# EAGLE design modEEGamp_v1.1 (EAGLE 7.6.0)
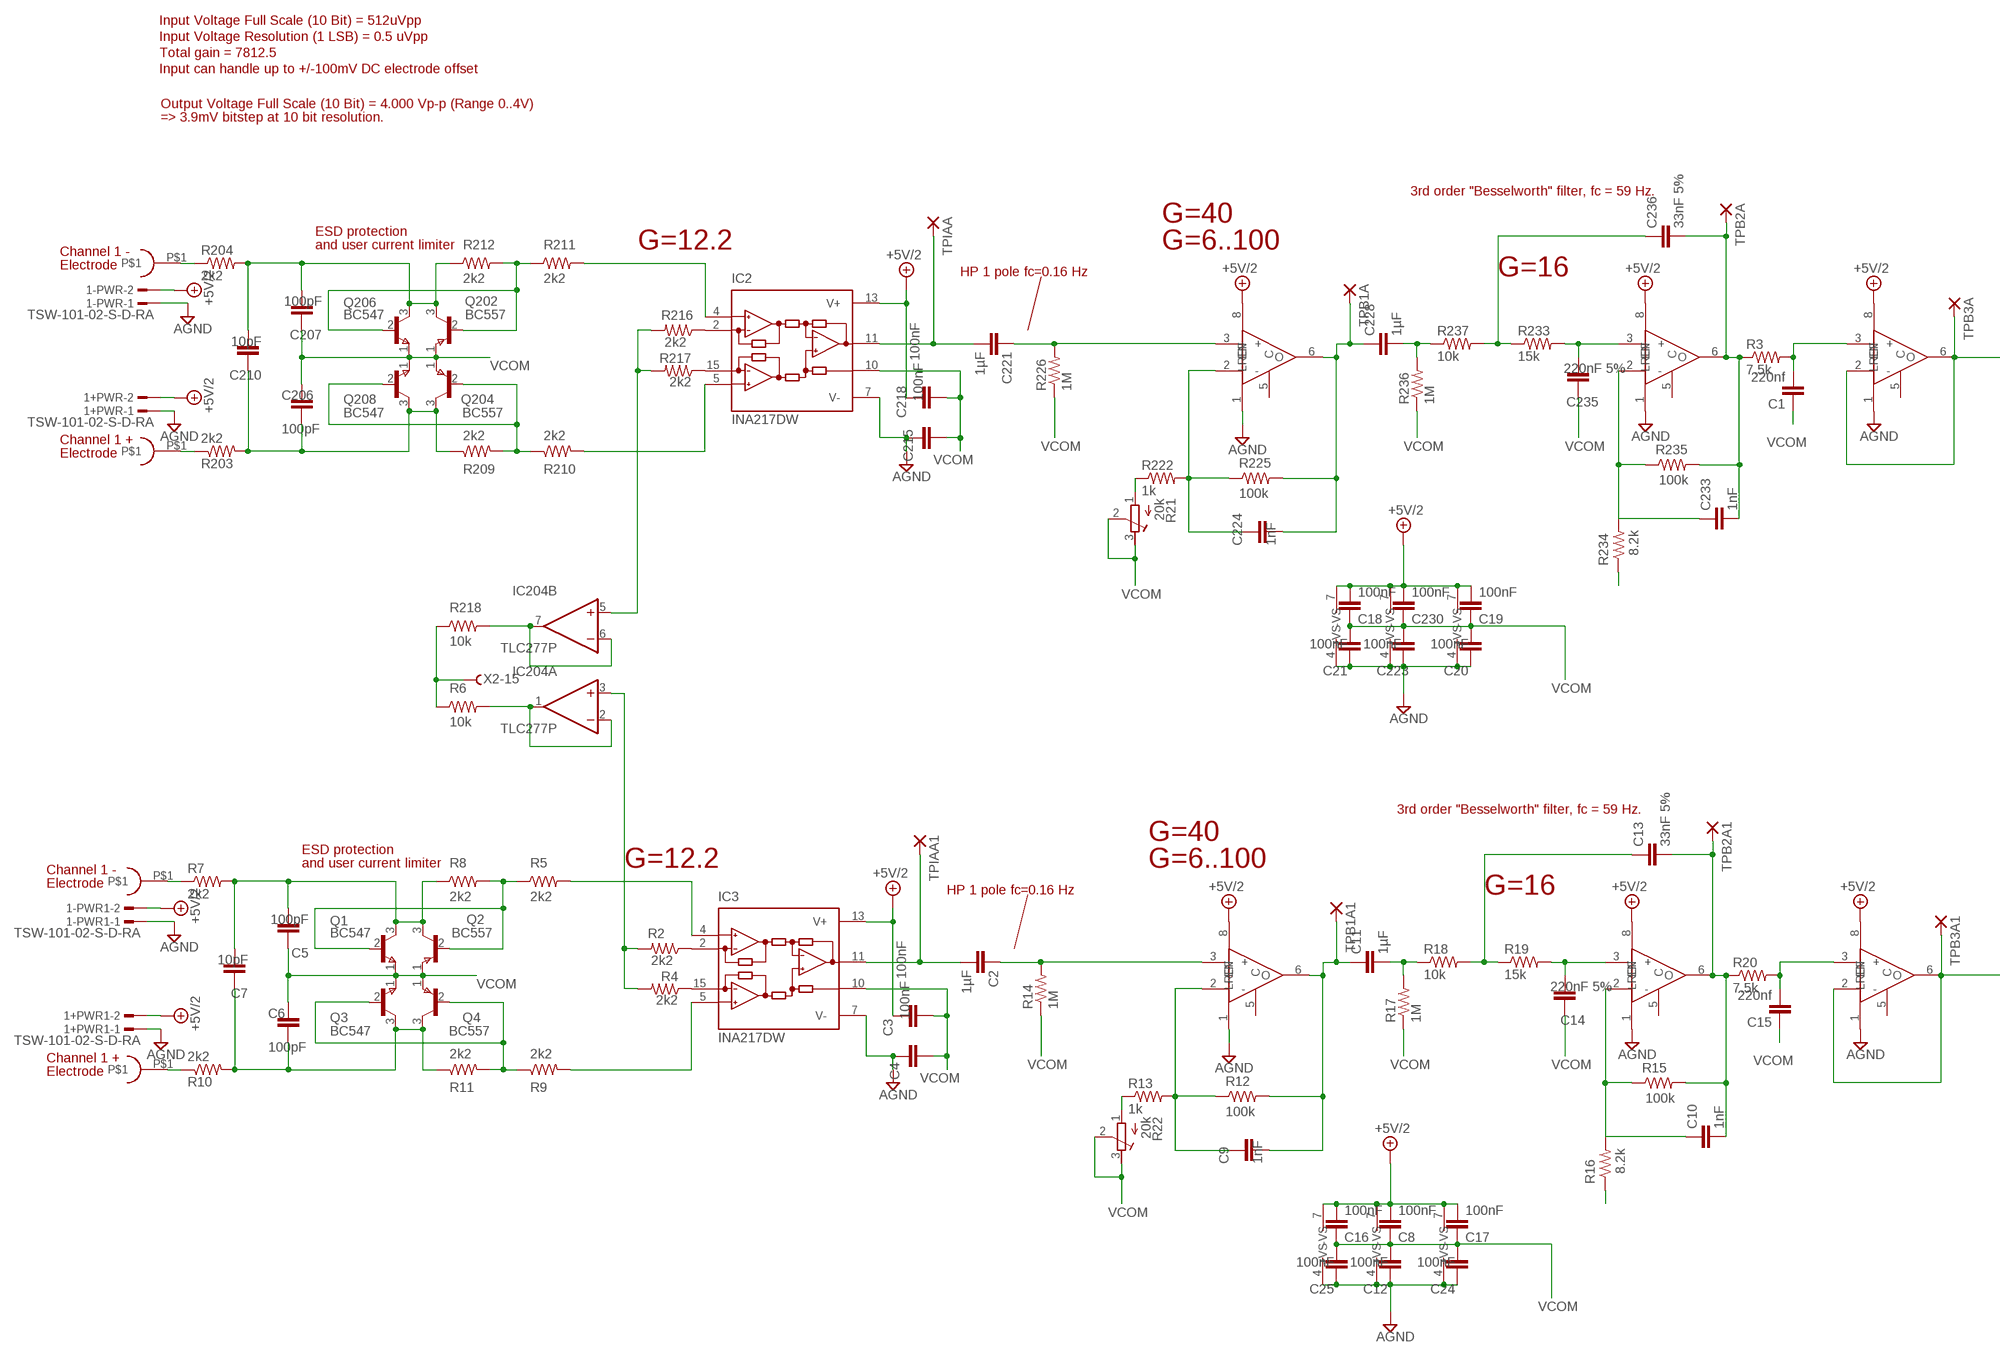
[diagram p0: schematic, sheet 1, part 1 of 2]
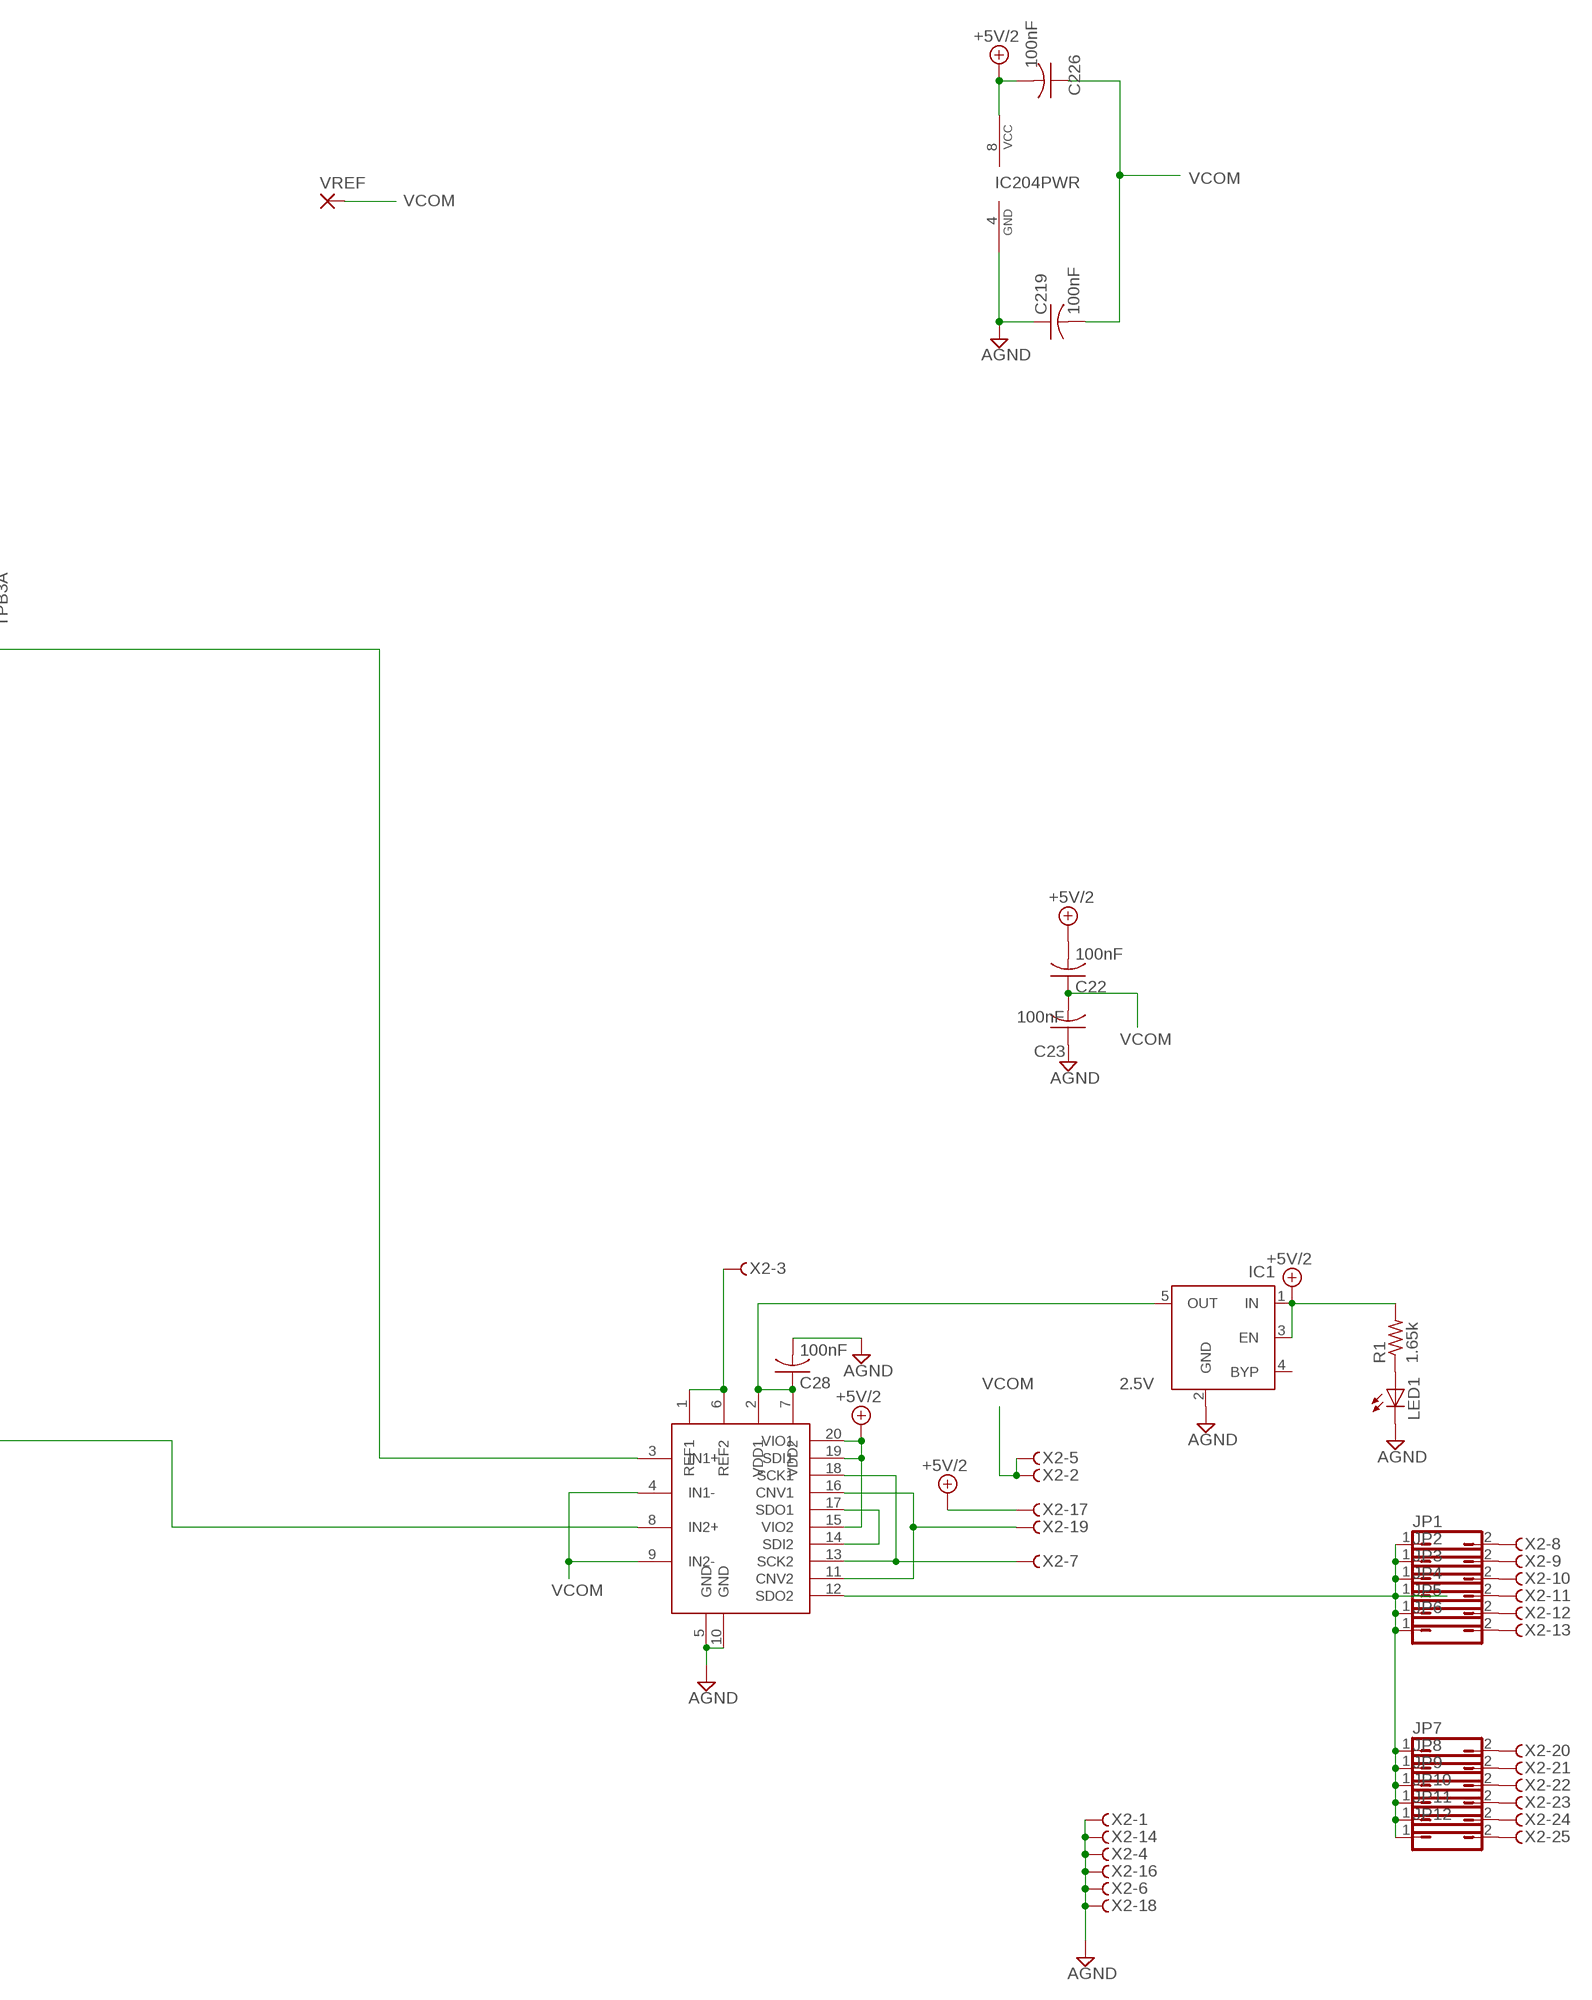
[diagram p1: schematic, sheet 1, part 2 of 2]

## Parts
1+PWR  TSW-101-02-S-D-RA  [TSW-101-02-S-D-RA]
1+PWR1  TSW-101-02-S-D-RA  [TSW-101-02-S-D-RA]
1-PWR  TSW-101-02-S-D-RA  [TSW-101-02-S-D-RA]
1-PWR1  TSW-101-02-S-D-RA  [TSW-101-02-S-D-RA]
C1  220nf  C-EUC1206  [C1206]
C1+  DIN42802  [DIN42802]
C1+1  DIN42802  [DIN42802]
C1-  DIN42802  [DIN42802]
C1-1  DIN42802  [DIN42802]
C2  1µF  C-EU050-024X044  [C050-024X044]
C3  100nF  C-EUC1206  [C1206]
C4  100nF  C-EUC1206  [C1206]
C5  100pF  C-EUC1206  [C1206]
C6  100pF  C-EUC1206  [C1206]
C7  10pF  C-EUC1206  [C1206]
C8  100nF  C-EUC1206  [C1206]
C9  1nF  C-EUC1206  [C1206]
C10  1nF  C-EUC1206  [C1206]
C11  1µF  C-EU050-024X044  [C050-024X044]
C12  100nF  C-EUC1206  [C1206]
C13  33nF 5%  C-EUC1206  [C1206]
C14  220nF 5%  C-EUC1206  [C1206]
C15  220nf  C-EUC1206  [C1206]
C16  100nF  C-EUC1206  [C1206]
C17  100nF  C-EUC1206  [C1206]
C18  100nF  C-EUC1206  [C1206]
C19  100nF  C-EUC1206  [C1206]
C20  100nF  C-EUC1206  [C1206]
C21  100nF  C-EUC1206  [C1206]
C22  100nF  C-USC1206  [C1206]
C23  100nF  C-USC1206  [C1206]
C24  100nF  C-EUC1206  [C1206]
C25  100nF  C-EUC1206  [C1206]
C28  100nF  C-USC1206  [C1206]
C206  100pF  C-EUC1206  [C1206]
C207  100pF  C-EUC1206  [C1206]
C210  10pF  C-EUC1206  [C1206]
C215  100nF  C-EUC1206  [C1206]
C218  100nF  C-EUC1206  [C1206]
C219  100nF  C-USC1206  [C1206]
C221  1µF  C-EU050-024X044  [C050-024X044]
C223  100nF  C-EUC1206  [C1206]
C224  1nF  C-EUC1206  [C1206]
C226  100nF  C-USC1206  [C1206]
C228  1µF  C-EU050-024X044  [C050-024X044]
C230  100nF  C-EUC1206  [C1206]
C233  1nF  C-EUC1206  [C1206]
C235  220nF 5%  C-EUC1206  [C1206]
C236  33nF 5%  C-EUC1206  [C1206]
IC1  2.5V  MIC5219XX  [SOT23-5]
IC2  INA217DW  [DW_RPDSO-G16]
IC3  INA217DW  [DW_RPDSO-G16]
IC204  TLC277P  [DIL-08]
JP1  JP1Q  [JP1]
JP2  JP1Q  [JP1]
JP3  JP1Q  [JP1]
JP4  JP1Q  [JP1]
JP5  JP1Q  [JP1]
JP6  JP1Q  [JP1]
JP7  JP1Q  [JP1]
JP8  JP1Q  [JP1]
JP9  JP1Q  [JP1]
JP10  JP1Q  [JP1]
JP11  JP1Q  [JP1]
JP12  JP1Q  [JP1]
LED1  LED3MM  [LED3MM]
Q1  BC547  [TO92]
Q2  BC557  [TO92]
Q3  BC547  [TO92]
Q4  BC557  [TO92]
Q202  BC557  [TO92]
Q204  BC557  [TO92]
Q206  BC547  [TO92]
Q208  BC547  [TO92]
R1  1.65k  R-US_R1206  [R1206]
R2  2k2  R-US_R1206  [R1206]
R3  7.5k  R-US_R1206  [R1206]
R4  2k2  R-US_R1206  [R1206]
R5  2k2  R-US_R1206  [R1206]
R6  10k  R-US_R1206  [R1206]
R7  2k2  R-US_R1206  [R1206]
R8  2k2  R-US_R1206  [R1206]
R9  2k2  R-US_R1206  [R1206]
R10  2k2  R-US_R1206  [R1206]
R11  2k2  R-US_R1206  [R1206]
R12  100k  R-US_R1206  [R1206]
R13  1k  R-US_R1206  [R1206]
R14  1M  R-US_R1206  [R1206]
R15  100k  R-US_R1206  [R1206]
R16  8.2k  R-US_R1206  [R1206]
R17  1M  R-US_R1206  [R1206]
R18  10k  R-US_R1206  [R1206]
R19  15k  R-US_R1206  [R1206]
R20  7.5k  R-US_R1206  [R1206]
R21  20k  R-TRIMM3296W  [RTRIM3296W]
R22  20k  R-TRIMM3296W  [RTRIM3296W]
R203  2k2  R-US_R1206  [R1206]
R204  2k2  R-US_R1206  [R1206]
R209  2k2  R-US_R1206  [R1206]
R210  2k2  R-US_R1206  [R1206]
R211  2k2  R-US_R1206  [R1206]
R212  2k2  R-US_R1206  [R1206]
R216  2k2  R-US_R1206  [R1206]
R217  2k2  R-US_R1206  [R1206]
R218  10k  R-US_R1206  [R1206]
R222  1k  R-US_R1206  [R1206]
R225  100k  R-US_R1206  [R1206]
R226  1M  R-US_R1206  [R1206]
R233  15k  R-US_R1206  [R1206]
R234  8.2k  R-US_R1206  [R1206]
R235  100k  R-US_R1206  [R1206]
R236  1M  R-US_R1206  [R1206]
R237  10k  R-US_R1206  [R1206]
TPB1A  1,6/0,8  [1,6/0,8]
TPB1A1  1,6/0,8  [1,6/0,8]
TPB2A  1,6/0,8  [1,6/0,8]
TPB2A1  1,6/0,8  [1,6/0,8]
TPB3A  1,6/0,8  [1,6/0,8]
TPB3A1  1,6/0,8  [1,6/0,8]
TPIAA  1,6/0,8  [1,6/0,8]
TPIAA1  1,6/0,8  [1,6/0,8]
U$1  AD7902  [QSOP20]
U$10  AD8021  [SOIC8]
U$12  AD8021  [SOIC8]
U$20  AD8021  [SOIC8]
U$30  AD8021  [SOIC8]
U$31  AD8021  [SOIC8]
U$36  AD8021  [SOIC8]
VREF  1,6/0,8  [1,6/0,8]
X2  F25HPS  [F25HP]

## Nets
+5V/2: 1+PWR1.2 1+PWR.2 1-PWR1.2 1-PWR.2 C3.1 C8.2 C16.2 C17.2 C18.2 C19.2 C22.2 C218.1 C226.2 C230.2 IC1.1(IN) IC1.3(EN) IC2.13(V+) IC3.13(V+) IC204.8(PWR:VCC) R1.2 U$1.15(VIO2) U$1.19(SDI1) U$1.20(VIO1) U$10.7(SUPPLY:+VS) U$10.8(IC:EN) U$12.7(SUPPLY:+VS) U$12.8(IC:EN) U$20.7(SUPPLY:+VS) U$20.8(IC:EN) U$30.7(SUPPLY:+VS) U$30.8(IC:EN) U$31.7(SUPPLY:+VS) U$31.8(IC:EN) U$36.7(SUPPLY:+VS) U$36.8(IC:EN) X2.17
ADIN0: TPB3A.1(P) U$1.3(IN1+) U$20.2(IC:-) U$20.6(IC:O)
ADIN1: TPB3A1.1(P) U$1.8(IN2+) U$36.2(IC:-) U$36.6(IC:O)
AGND: 1+PWR1.1 1+PWR.1 1-PWR1.1 1-PWR.1 C4.1 C12.1 C20.1 C21.1 C23.1 C24.1 C25.1 C28.2 C215.1 C219.1 C223.1 IC1.2(GND) IC2.7(V-) IC3.7(V-) IC204.4(PWR:GND) LED1.K(C) U$1.5(GND) U$1.10(GND) U$10.1(IC:LREF) U$10.4(SUPPLY:-VS) U$12.1(IC:LREF) U$12.4(SUPPLY:-VS) U$20.1(IC:LREF) U$20.4(SUPPLY:-VS) U$30.1(IC:LREF) U$30.4(SUPPLY:-VS) U$31.1(IC:LREF) U$31.4(SUPPLY:-VS) U$36.1(IC:LREF) U$36.4(SUPPLY:-VS) X2.1 X2.4 X2.6 X2.14 X2.16 X2.18
CNV: U$1.11(CNV2) U$1.16(CNV1) X2.19
N$1: U$1.1(REF1) U$1.6(REF2) X2.3
N$2: C28.1 IC1.5(OUT) U$1.2(VDD1) U$1.7(VDD2)
N$3: JP1.1 JP2.1 JP3.1 JP4.1 JP5.1 JP6.1 JP7.1 JP8.1 JP9.1 JP10.1 JP11.1 JP12.1 U$1.12(SDO2)
N$4: U$1.14(SDI2) U$1.17(SDO1)
N$5: C1-.P$1 R204.1
N$6: R13.1 R22.1(A)
N$7: C1+.P$1 R203.1
N$8: R21.1(A) R222.1
N$9: LED1.A R1.1
N$10: JP1.2 X2.8
N$11: JP2.2 X2.9
N$12: IC204.5(B:+IN) R216.2 R217.2
N$13: C233.2 C236.2 R3.1 R235.2 TPB2A.1(P) U$12.6(IC:O)
N$14: IC2.2(RG1) R216.1
N$15: C1.2 R3.2 U$20.3(IC:+)
N$16: IC204.3(A:+IN) R2.2 R4.2
N$17: C2.2 IC3.11(OUT) TPIAA1.1(P)
N$18: IC3.4(-IN) R5.2
N$19: IC3.5(+IN) R9.2
N$20: IC2.15(RG2) R217.1
N$21: IC2.4(-IN) R211.2
N$22: Q1.2(B) Q2.2(B) R5.1 R8.2
N$23: C5.2 C7.2 Q1.3(C) Q2.3(C) R7.2 R8.1
N$24: Q3.2(B) Q4.2(B) R9.1 R11.2
N$25: C221.2 IC2.11(OUT) TPIAA.1(P)
N$26: C6.1 C7.1 Q3.3(C) Q4.3(C) R10.2 R11.1
N$27: IC2.5(+IN) R210.2
N$28: C221.1 R226.2 U$10.3(IC:+)
N$29: Q202.2(B) Q206.2(B) R211.1 R212.2
N$30: C1-1.P$1 R7.1
N$31: C1+1.P$1 R10.1
N$32: C207.2 C210.2 Q202.3(C) Q206.3(C) R204.2 R212.1
N$33: C2.1 R14.2 U$30.3(IC:+)
N$34: C9.1 R12.1 R13.2 U$30.2(IC:-)
N$35: IC204.1(A:OUT) IC204.2(A:-IN) R6.2
N$36: JP3.2 X2.10
N$37: C9.2 C11.1 R12.2 TPB1A1.1(P) U$30.6(IC:O)
N$38: C224.1 R222.2 R225.1 U$10.2(IC:-)
N$39: Q204.2(B) Q208.2(B) R209.2 R210.1
N$40: JP4.2 X2.11
N$41: C13.1 R18.2 R19.1
N$42: C224.2 C228.1 R225.2 TPB1A.1(P) U$10.6(IC:O)
N$43: C206.1 C210.1 Q204.3(C) Q208.3(C) R203.2 R209.1
N$44: C14.2 R19.2 U$31.3(IC:+)
N$45: C11.2 R17.2 R18.1
N$46: C10.1 R15.1 R16.2 U$31.2(IC:-)
N$47: IC3.2(RG1) R2.1
N$48: IC3.15(RG2) R4.1
N$49: C233.1 R234.2 R235.1 U$12.2(IC:-)
N$50: C228.2 R236.2 R237.1
N$51: C236.1 R233.1 R237.2
N$52: IC204.6(B:-IN) IC204.7(B:OUT) R218.2
N$53: C10.2 C13.2 R15.2 R20.1 TPB2A1.1(P) U$31.6(IC:O)
N$54: C15.2 R20.2 U$36.3(IC:+)
N$55: JP5.2 X2.12
N$56: JP6.2 X2.13
N$57: C235.2 R233.2 U$12.3(IC:+)
N$58: JP7.2 X2.20
N$59: JP8.2 X2.21
N$60: JP9.2 X2.22
N$61: JP10.2 X2.23
N$62: JP11.2 X2.24
N$63: JP12.2 X2.25
N$66: R6.1 R218.1 X2.15
SCK: U$1.13(SCK2) U$1.18(SCK1) X2.7
VCOM: C1.1 C3.2 C4.2 C5.1 C6.2 C8.1 C12.2 C14.1 C15.1 C16.1 C17.1 C18.1 C19.1 C20.2 C21.2 C22.1 C23.2 C24.2 C25.2 C206.2 C207.1 C215.2 C218.2 C219.2 C223.2 C226.1 C230.1 C235.1 IC2.10(REF) IC3.10(REF) Q1.1(E) Q2.1(E) Q3.1(E) Q4.1(E) Q202.1(E) Q204.1(E) Q206.1(E) Q208.1(E) R14.1 R16.1 R17.1 R21.2(S) R21.3(E) R22.2(S) R22.3(E) R226.1 R234.1 R236.1 U$1.4(IN1-) U$1.9(IN2-) VREF.1(P) X2.2 X2.5
Unconnected: IC1.4(BYP) U$10.5(IC:C) U$12.5(IC:C) U$20.5(IC:C) U$30.5(IC:C) U$31.5(IC:C) U$36.5(IC:C)

## Notes on the sheet
- Input Voltage Full Scale (10 Bit) = 512uVpp
- Input Voltage Resolution (1 LSB) = 0.5 uVpp
- Total gain = 7812.5
- Input can handle up to +/-100mV DC electrode offset
- Output Voltage Full Scale (10 Bit) = 4.000 Vp-p (Range 0..4V)
- => 3.9mV bitstep at 10 bit resolution.
- 3rd order "Besselworth" filter, fc = 59 Hz.
- G=40
- ESD protection
- and user current limiter | G=12.2 | G=6..100
- Channel 1 -
- Electrode
- HP 1 pole fc=0.16 Hz | G=16
- Channel 1 +
- Electrode
- 3rd order "Besselworth" filter, fc = 59 Hz.
- G=40
- ESD protection
- and user current limiter | G=12.2 | G=6..100
- Channel 1 -
- Electrode
- HP 1 pole fc=0.16 Hz | G=16
- Channel 1 +
- Electrode

## Library data of the parts
1+PWR 1+PWR1 1-PWR 1-PWR1 = con-samtec:TSW-101-02-S-D: THROUGH-HOLE .025" SQ POST HEADER Source: Samtec TSW.pdf; OC_FARNELL: unknown; OC_NEWARK: unknown
C1-C21 C24 C25 C206 C207 C210 C215 C218 C221 C223 C224 C228 C230 C233 C235 C236 = resistor:C-EU: CAPACITOR, European symbol
C1+ C1+1 C1- C1-1 = modEEG:DIN42802; PN: Plastics1 41828
C22 C23 C28 C219 C226 = resistor:C-US: CAPACITOR, American symbol
IC1 = v-reg-micrel:MIC5219XX: VOLTAGE REGULATOR; OC_FARNELL: unknown; OC_NEWARK: unknown
IC2 IC3 = burr-brown:INA217: Low-Noise, Low-Distortion INSTRUMENTATION AMPLIFIER Replacement for SSM2017 Source: http://focus.ti.com/lit/ds/symlink/ina217.pdf; MF: TEXAS INSTRUMENTS; MPN: INA217AIDWT; OC_FARNELL: 1459470; OC_NEWARK: 02E2758
IC204 = BURR:TLC277P
JP1-JP12 = jumper:JP1Q: JUMPER
LED1 = led:LED: LED OSRAM: - CHIPLED LG R971, LG N971, LY N971, LG Q971, LY Q971, LO R971, LY R971 LH N974, LH R974 LS Q976, LO Q976, LY Q976 LO Q996 - Hyper CHIPLED LW Q18S LB Q993, LB Q99A, LB R99A - SideLED LS A670, LO A670, LY A670, LG A670, LP A670 LB A673, LV A673, LT A673, LW A673 LH A674 LY A675 LS A676, LA A676, LO A676, LY A676, LW A676 LS A679, LY A679, LG A679 - Hyper Micro SIDELED® LS Y876, LA Y876, LO Y876, LY Y876 LT Y87S - SmartLED LW L88C, LW L88S LB L89C, LB L89S, LG L890 LS L89K, LO L89K, LY L89K LS L896, LA L896, LO L896, LY L896 - TOPLED LS T670, LO T670, LY T670, LG T670, LP T670 LSG T670, LSP T670, LSY T670, LOP T670, LYG T670 LG T671, LOG T671, LSG T671 LB T673, LV T673, LT T673, LW T673 LH T674 LS T676, LA T676, LO T676, LY T676, LB T676, LH T676, LSB T676, LW T676 LB T67C, LV T67C, LT T67C, LS T67K, LO T67K, LY T67K, LW E67C LS E67B, LA E67B, LO E67B, LY E67B, LB E67C, LV E67C, LT E67C LW T67C LS T679, LY T679, LG T679 LS T770, LO T770, LY T770, LG T770, LP T770 LB T773, LV T773, LT T773, LW T773 LH T774 LS E675, LA E675, LY E675, LS T675 LS T776, LA T776, LO T776, LY T776, LB T776 LHGB T686 LT T68C, LB T68C - Hyper Mini TOPLED® LB M676 - Mini TOPLED Santana® LG M470 LS M47K, LO M47K, LY M47K Source: http://www.osram.convergy.de LUXEON: - LUMILED® LXK2-PW12-R00, LXK2-PW12-S00, LXK2-PW14-U00, LXK2-PW14-V00 LXK2-PM12-R00, LXK2-PM12-S00, LXK2-PM14-U00 LXK2-PE12-Q00, LXK2-PE12-R00, LXK2-PE12-S00, LXK2-PE14-T00, LXK2-PE14-U00 LXK2-PB12-K00, LXK2-PB12-L00, LXK2-PB12-M00, LXK2-PB14-N00, LXK2-PB14-P00, LXK2-PB14-Q00 LXK2-PR12-L00, LXK2-PR12-M00, LXK2-PR14-Q00, LXK2-PR14-R00 LXK2-PD12-Q00, LXK2-PD12-R00, LXK2-PD12-S00 LXK2-PH12-R00, LXK2-PH12-S00 LXK2-PL12-P00, LXK2-PL12-Q00, LXK2-PL12-R00 Source: www.luxeon.com KINGBRIGHT: KA-3528ASYC Source: www.kingbright.com
Q1 Q3 Q206 Q208 = NPN:BC547
Q2 Q4 Q202 Q204 = pnp:BC557
R1-R20 R203 R204 R209-R212 R216-R218 R222 R225 R226 R233-R237 = resistor:R-US_: RESISTOR, American symbol
R21 R22 = resistor:R-TRIMM: Trimm resistor
TPB1A TPB1A1 TPB2A TPB2A1 TPB3A TPB3A1 TPIAA TPIAA1 VREF = WIREPAD:1,6/0,8: THROUGH-HOLE PAD
U$1 = EEG:AD7902
U$10 U$12 U$20 U$30 U$31 U$36 = EEG:AD8021
X2 = con-subd:F25?S: SUB-D; OC_FARNELL: unknown; OC_NEWARK: unknown

## Board
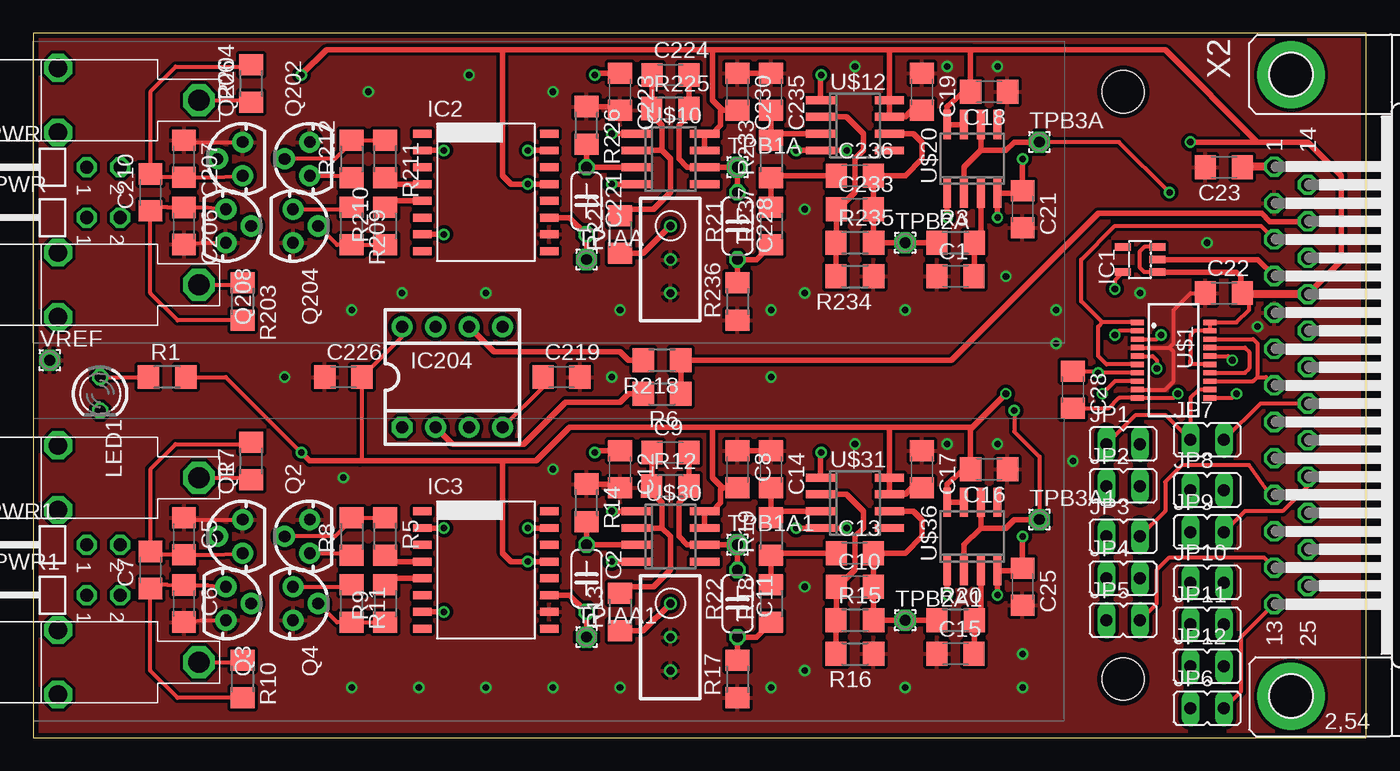
[diagram p2: board, top side]
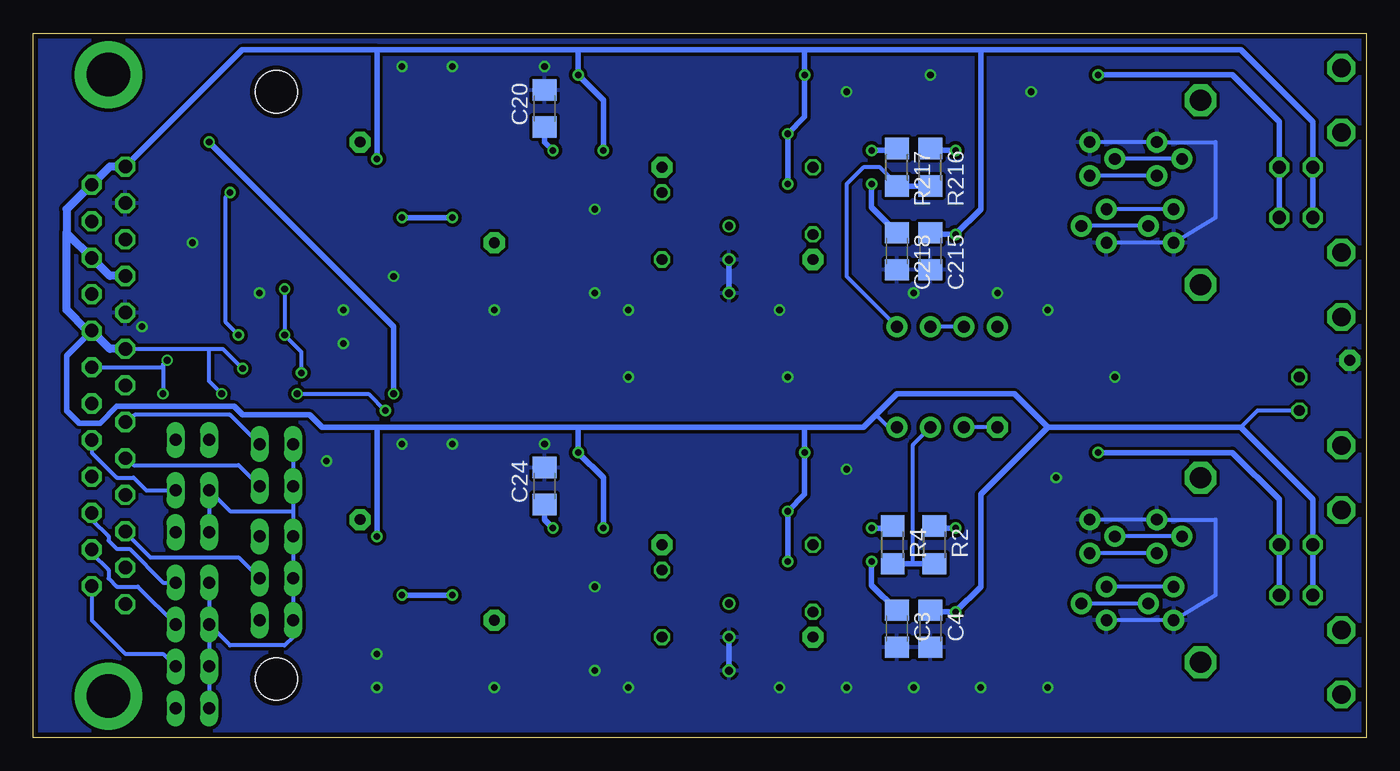
[diagram p3: board, bottom side, seen from below]

Size 100.97 x 53.34 mm. Coordinates in mm from the lower left corner, seen from the top.
Outline: 0,0 100.97,0 100.97,53.34 0,53.34 0,0
Copper layers (1*16): Top 0.0356mm / dielectric 1.5011mm / Bottom 0.0356mm
Design rules "Oshpark": minimum track width 6mil, minimum drill 13mil, track to track 6mil, track to pad 6mil, pad to pad 6mil, via to via 6mil, smd to smd 6mil, copper to edge 15mil, drill to drill 6mil, minimum pad ring 7mil, minimum via ring 7mil, stop-mask expansion 3mil, vias tented up to drill 0mil, thermal gap 10mil
Holes 3.2 mm at 82.55,4.45 82.55,48.9

### Footprints (pad centres in the part's own frame; a part is rotated, then mirrored left to right if it is on the bottom)
TSW-101-02-S-D-RA = drill 1 pad 1.5 octagon: 1 0,1.524; 2 0,4.064
C1206 = smd 1.6 x 1.8: 1 -1.4,0; 2 1.4,0
DIN42802 = drill 1.4 octagon: MNT -2.446,0; MNT@1 2.446,0 | drill 1.6 octagon: P$1 0,-10.655
C050-024X044 = drill 0.813 octagon: 1 -2.54,0; 2 2.54,0
SOT23-5 = smd 0.55 x 1.2: 1 -0.95,-1.3; 2 0,-1.3; 3 0.95,-1.3; 4 0.95,1.3; 5 -0.95,1.3
DW_RPDSO-G16 = smd 0.6 x 1.4: 1 -4.445,-4.8; 2 -3.175,-4.8; 3 -1.905,-4.8; 4 -0.635,-4.8; 5 0.635,-4.8; 6 1.905,-4.8; 7 3.175,-4.8; 8 4.445,-4.8; 9 4.445,4.8; 10 3.175,4.8; 11 1.905,4.8; 12 0.635,4.8; 13 -0.635,4.8; 14 -1.905,4.8; 15 -3.175,4.8; 16 -4.445,4.8
DIL-08 = drill 0.889 pad 1.6 octagon: 1 -3.81,-3.81 | drill 0.889 pad 1.6: 2 -1.27,-3.81; 3 1.27,-3.81; 4 3.81,-3.81; 5 3.81,3.81; 6 1.27,3.81; 7 -1.27,3.81; 8 -3.81,3.81
JP1 = drill 0.914 long: 1 0,-1.27; 2 0,1.27
LED3MM = drill 0.813 octagon: A -1.27,0; K 1.27,0
TO92 = drill 0.889 pad 1.6: 1 1.27,0; 2 0,1.905; 3 -1.27,0
R1206 = smd 1.6 x 1.803: 1 -1.422,0; 2 1.422,0
RTRIM3296W = drill 0.61: 1 0,-2.54; 2 0,0; 3 0,2.54
1,6/0,8 = drill 0.813 pad 1.6 octagon: 1 0,0
QSOP20 = smd 0.4 x 1: 1 -2.858,-2.75; 2 -2.223,-2.75; 3 -1.588,-2.75; 4 -0.953,-2.75; 5 -0.318,-2.75; 6 0.318,-2.75; 7 0.953,-2.75; 8 1.588,-2.75; 9 2.223,-2.75; 10 2.858,-2.75; 11 2.858,2.75; 12 2.223,2.75; 13 1.588,2.75; 14 0.953,2.75; 15 0.318,2.75; 16 -0.318,2.75; 17 -0.953,2.75; 18 -1.588,2.75; 19 -2.223,2.75; 20 -2.858,2.75
SOIC8 = smd 2.2 x 0.6: 1 -2.6,1.905; 2 -2.6,0.635; 3 -2.6,-0.635; 4 -2.6,-1.905; 5 2.6,-1.905; 6 2.6,-0.635; 7 2.6,0.635; 8 2.6,1.905
F25HP = drill 1.016 octagon: 1 -16.561,-1.27; 2 -13.792,-1.27; 3 -11.049,-1.27; 4 -8.28,-1.27; 5 -5.512,-1.27; 6 -2.769,-1.27; 7 0,-1.27; 8 2.769,-1.27; 9 5.512,-1.27; 10 8.28,-1.27; 11 11.049,-1.27; 12 13.792,-1.27; 13 16.561,-1.27; 14 -15.189,1.27; 15 -12.421,1.27; 16 -9.652,1.27; 17 -6.909,1.27; 18 -4.14,1.27; 19 -1.372,1.27; 20 1.372,1.27; 21 4.14,1.27; 22 6.909,1.27; 23 9.652,1.27; 24 12.421,1.27; 25 15.189,1.27 | drill 3.302 pad 5.08: G1 -23.52,0; G2 23.52,0

### Placement (x,y rotation side)
1+PWR  2.54,39.37 270 top
1+PWR1  2.54,10.79 270 top
1-PWR  2.54,43.18 270 top
1-PWR1  2.54,14.61 270 top
C1  69.85,34.92 0 top
C1+  1.91,34.29 90 top
C1+1  1.91,5.71 90 top
C1-  1.91,48.26 90 top
C1-1  1.91,19.68 90 top
C2  41.91,12.06 270 top
C3  35.56,8.26 270 bottom
C4  33.02,8.26 270 bottom
C5  11.43,15.24 270 top
C6  11.43,10.16 270 top
C7  8.89,12.7 90 top
C8  53.34,20.32 270 top
C9  48.26,21.59 0 top
C10  62.23,11.43 0 top
C11  53.34,10.16 270 top
C12  44.45,20.32 270 top
C13  62.23,13.97 0 top
C14  55.88,20.32 270 top
C15  69.85,6.35 0 top
C16  72.39,20.32 180 top
C17  67.31,20.32 270 top
C18  72.39,48.9 180 top
C19  67.31,48.9 270 top
C20  62.23,47.62 90 bottom
C21  74.93,40.01 270 top
C22  90.17,33.66 0 top
C23  90.17,43.18 180 top
C24  62.23,19.05 90 bottom
C25  74.93,11.43 270 top
C28  78.74,26.35 270 top
C206  11.43,38.73 270 top
C207  11.43,43.81 270 top
C210  8.89,41.27 90 top
C215  33.02,36.83 270 bottom
C218  35.56,36.83 270 bottom
C219  40.01,27.3 0 top
C221  41.91,40.64 270 top
C223  44.45,48.9 270 top
C224  48.26,50.16 0 top
C226  23.5,27.3 0 top
C228  53.34,38.73 270 top
C230  53.34,48.9 270 top
C233  62.23,40.01 0 top
C235  55.88,48.9 270 top
C236  62.23,42.55 0 top
IC1  83.82,36.2 90 top
IC2  34.29,41.27 270 top
IC3  34.29,12.7 270 top
IC204  31.75,27.3 0 top
JP1  82.55,22.23 270 top
JP2  82.55,19.05 270 top
JP3  82.55,15.24 270 top
JP4  82.55,12.06 270 top
JP5  82.55,8.89 270 top
JP6  88.9,2.22 270 top
JP7  88.9,22.54 270 top
JP8  88.9,18.73 270 top
JP9  88.9,15.56 270 top
JP10  88.9,11.75 270 top
JP11  88.9,8.57 270 top
JP12  88.9,5.4 270 top
LED1  5.08,26.04 270 top
Q1  15.88,15.24 90 top
Q2  20.95,15.24 90 top
Q3  14.61,10.16 270 top
Q4  19.68,10.16 270 top
Q202  20.95,43.81 90 top
Q204  19.68,38.73 270 top
Q206  15.88,43.81 90 top
Q208  14.61,38.73 270 top
R1  10.16,27.3 0 top
R2  32.7,14.61 270 bottom
R3  69.85,37.47 0 top
R4  35.88,14.61 270 bottom
R5  26.67,15.24 270 top
R6  47.62,26.04 180 top
R7  16.51,20.95 90 top
R8  24.13,15.24 90 top
R9  26.67,10.16 90 top
R10  15.88,4.45 270 top
R11  24.13,10.16 270 top
R12  48.26,19.05 0 top
R13  44.45,9.53 90 top
R14  41.91,17.78 270 top
R15  62.23,8.89 0 top
R16  62.23,6.35 180 top
R17  53.34,4.45 90 top
R18  55.88,10.16 90 top
R19  55.88,15.24 90 top
R20  69.85,8.89 0 top
R21  48.26,36.2 180 top
R22  48.26,7.62 180 top
R203  15.88,33.02 270 top
R204  16.51,49.53 90 top
R209  24.13,38.73 270 top
R210  26.67,38.73 90 top
R211  26.67,43.81 270 top
R212  24.13,43.81 90 top
R216  33.02,43.18 270 bottom
R217  35.56,43.18 270 bottom
R218  47.62,28.57 180 top
R222  44.45,38.1 90 top
R225  48.26,47.62 0 top
R226  41.91,46.35 270 top
R233  55.88,43.81 90 top
R234  62.23,34.92 180 top
R235  62.23,37.47 0 top
R236  53.34,33.02 90 top
R237  55.88,38.73 90 top
TPB1A  53.34,43.18 0 top
TPB1A1  53.34,14.61 0 top
TPB2A  66.04,37.47 0 top
TPB2A1  66.04,8.89 0 top
TPB3A  76.2,45.09 0 top
TPB3A1  76.2,16.51 0 top
TPIAA  41.91,36.2 0 top
TPIAA1  41.91,7.62 0 top
U$1  86.36,28.57 270 top
U$10  48.26,43.81 0 top
U$12  62.23,46.35 0 top
U$20  71.12,43.81 90 top
U$30  48.26,15.24 0 top
U$31  62.23,17.78 0 top
U$36  71.12,15.24 90 top
VREF  1.27,28.57 0 top
X2  95.25,26.67 270 top

### Tracks (layer width: path | path; a pad name or v marks a point on that pad's centre or on a via)
+5V/2  (via drill 0.5)
  Top 0.305: 92.08,33.58 92.08,32.38 91.12,31.43 U$1.20 U$1.19 87.95,30.8 87.63,30.48 87.63,28.57 87.63,28.26 U$1.15 | IC1.3 84.14,37.15 83.82,36.83 83.82,35.56 84.14,35.24 IC1.1 | R1.2 14.61,27.3 v20.32,21.59 | IC204.8 27.94,30.35 C226.2 24.89,21.09 24.77,20.95
  Top 0.406: IC1.1 91.12,35.24 91.44,34.92 91.44,33.78 C22.2 | 71.12,52.07 64.77,52.07 | 64.77,52.07 51.44,52.07 | 51.44,52.07 35.56,52.07 | 35.56,52.07 22.23,52.07 v20.32,50.16 | IC2.13 v37.47,41.91 36.2,41.91 35.56,42.55 35.56,52.07 | U$10.7 U$10.8 51.44,45.72 52.07,46.35 52.07,47.37 52.2,47.49 | 64.77,52.07 64.83,52.01 U$12.8 U$12.7 66.04,46.99 66.55,47.49 C19.2 | U$20.7 U$20.8 69.22,47.76 70.48,48.9 C18.2 70.99,51.94 71.12,52.07 | C230.2 52.2,47.49 | 52.2,47.49 51.44,48.26 51.44,52.07 | 71.12,23.5 64.77,23.5 | 64.77,23.5 51.44,23.5 | 51.44,23.5 40.64,23.5 38.1,20.95 35.56,20.95 | IC3.13 v37.47,13.34 36.2,13.34 35.56,13.97 35.56,20.95 | U$30.7 U$30.8 51.44,17.14 52.07,17.78 52.07,18.79 52.2,18.92 | 64.77,23.5 64.83,23.43 U$31.8 U$31.7 66.04,18.41 66.55,18.92 C17.2 | U$36.7 U$36.8 69.22,19.18 70.48,20.32 C16.2 70.99,23.36 71.12,23.5 | C8.2 52.2,18.92 | 52.2,18.92 51.44,19.68 51.44,23.5 | 71.12,52.07 85.72,52.07 92.71,45.09 | 92.71,45.09 96.52,45.09 99.06,42.55 99.06,36.12 X2.17 | 71.12,23.5 v73.66,26.04 | v87.63,45.09 92.71,45.09 | 35.56,20.95 24.77,20.95 20.95,20.95 v20.32,21.59
  Top 0.61: X2.17 92.08,33.58 91.65,33.58 C22.2
  Bottom 0.406: 1+PWR.2 1-PWR.2 6.6,46.61 10.16,50.16 v20.32,50.16 | v37.47,41.91 37.47,40.13 C218.1 | 1+PWR1.2 1-PWR1.2 6.6,18.03 10.16,21.59 v20.32,21.59 | v37.47,13.34 37.47,11.56 C3.1 | v73.66,26.04 73.66,31.11 v87.63,45.09
ADIN0  (via drill 0.5)
  Top 0.305: U$1.3 85.09,30.16 v85.41,30.48 | v86.04,41.27 82.23,45.09 TPB3A.1
  Top 0.406: U$20.6 71.75,44.45 | 71.75,44.45 70.48,43.18 U$20.2 | TPB3A.1 74.3,45.09 73.66,44.45 71.75,44.45
  Bottom 0.305: v85.41,30.48 86.36,31.43 86.36,40.96 v86.04,41.27
ADIN1  (via drill 0.5)
  Top 0.305: U$1.8 81.92,26.99 v80.96,26.04 | v74.3,24.77 74.3,23.18 76.2,21.27 TPB3A1.1
  Top 0.406: U$36.6 71.75,15.88 | 71.75,15.88 70.48,14.61 U$36.2 | TPB3A1.1 74.3,16.51 73.66,15.88 71.75,15.88
  Bottom 0.305: v80.96,26.04 75.56,26.04 v74.3,24.77
AGND  (via drill 0.5)
  Top 0.305: U$1.10 83.5,25.72 | U$1.5 84.77,28.89 85.09,28.57 v85.09,27.94 | U$1.10 86.36,25.72 v86.68,26.04 | C219.1 38.6,26.54 IC204.4 | C28.2 81.47,24.95 82.23,25.72 U$1.10
  Top 0.406: IC1.2 92.73,36.2 X2.4 | IC2.7 v31.11,38.1 | U$10.4 v43.81,41.91 | v43.81,45.72 U$10.1 | U$12.1 59.63,50.1 v59.69,50.16 | v57.78,44.45 U$12.4 v61.59,44.45 | U$20.1 v69.22,39.37 | v73.03,39.37 U$20.4 74.74,41.22 C21.1 v74.93,43.81 | C223.1 42.67,50.3 v42.55,50.16 | IC3.7 v31.11,9.53 | U$30.4 v43.81,13.34 | v43.81,17.14 U$30.1 | U$31.1 59.63,21.53 v59.69,21.59 | v57.78,15.88 U$31.4 v61.59,15.88 | U$36.1 v69.22,10.79 | v73.03,10.79 U$36.4 74.74,12.64 C25.1 v74.93,15.24 | C12.1 42.67,21.72 v42.55,21.59
  Top 0.61: X2.1 91.62,43.23 C23.1
  Bottom 0.305: X2.6 87.63,29.44 | 87.63,29.44 86.59,29.44 v85.09,27.94 | v86.68,26.04 87.63,26.99 87.63,29.44 | LED1.K 8.26,24.77 9.53,23.5 | IC204.4 36.2,23.5 37.15,24.45
  Bottom 0.406: 1+PWR.1 1-PWR.1 4.06,46.61 9.53,52.07 29.21,52.07 | 74.93,52.07 59.69,52.07 | 59.69,52.07 42.55,52.07 | 42.55,52.07 29.21,52.07 | C215.1 32.89,38.1 v31.11,38.1 29.21,40.01 29.21,52.07 | v43.81,41.91 v43.81,45.72 42.55,46.99 v42.55,50.16 42.55,52.07 | 59.69,52.07 v59.69,50.16 57.78,48.26 v57.78,44.45 | v61.59,44.45 62.23,45.09 C20.1 | v74.93,43.81 74.93,52.07 | v69.22,39.37 v73.03,39.37 | 1+PWR1.1 1-PWR1.1 4.06,18.03 9.53,23.5 24.13,23.5 | 74.93,23.5 59.69,23.5 | 59.69,23.5 42.55,23.5 | 42.55,23.5 38.1,23.5 37.15,24.45 35.56,26.04 26.67,26.04 24.13,23.5 | C4.1 32.89,9.53 v31.11,9.53 29.21,11.43 29.21,18.41 24.13,23.5 | v43.81,13.34 v43.81,17.14 42.55,18.41 v42.55,21.59 42.55,23.5 | 59.69,23.5 v59.69,21.59 57.78,19.68 v57.78,15.88 | v61.59,15.88 62.23,16.51 C24.1 | v74.93,15.24 74.93,23.5 | v69.22,10.79 v73.03,10.79 | 74.93,52.07 85.14,52.07 X2.1 | 74.93,23.5 79.06,23.5 80.01,24.45 85.09,24.45 85.72,25.08 94.61,25.08 95.89,23.81 97.47,23.81 98.42,24.77 98.42,28.91 X2.18
  Bottom 0.61: X2.6 95.15,29.44 X2.18 96.85,30.81 98.42,32.38 98.42,38.1 98.36,38.16 | X2.4 95.15,34.95 X2.16 98.36,38.16 | X2.1 95.15,43.23 X2.14 96.57,41.86 98.42,40.01 98.42,38.23 98.36,38.16
CNV  (via drill 0.5)
  Top 0.305: U$1.11 90.81,25.72 v91.12,26.04 | U$1.16 90.49,28.89 v90.81,28.57
  Bottom 0.305: v90.81,28.57 91.12,28.26 91.12,27.94 | 91.12,27.94 v91.12,26.04 | X2.19 91.22,28.04 91.12,27.94
N$1
  Top 0.305: 80.96,31.43 79.38,33.02 79.38,36.2 81.92,38.73 92.96,38.73 X2.3 | U$1.1 80.96,31.43 | 80.96,31.43 80.64,31.11 80.64,28.89 81.28,28.26 U$1.6
N$2  (via drill 0.5)
  Top 0.305: U$1.7 v80.64,27.62 80.51,27.75 C28.1 | U$1.2 82.23,30.8 v81.92,30.48 | IC1.5 81.92,34.61 v81.92,33.97
  Bottom 0.305: v80.64,27.62 80.64,29.21 v81.92,30.48 v81.92,33.97
N$3
  Top 0.305: U$1.12 88.26,26.35 87.63,25.72 JP7.1 85.72,24.45 83.5,24.45 JP1.1
  Bottom 0.305: JP1.1 JP2.1 81.28,17.14 | 81.28,17.14 JP3.1 JP4.1 JP5.1 81.28,7.62 81.92,6.99 86.04,6.99 JP11.1 | JP9.1 JP8.1 86.04,17.14 81.28,17.14 | JP10.1 JP11.1 | JP11.1 JP12.1 JP6.1
N$4
  Top 0.305: U$1.14 91.76,27.62 92.08,27.94 92.08,29.21 91.76,29.53 U$1.17
N$5
  Top 0.305: C1-.P$1 16.36,48.26 R204.1
N$6
  Top 0.406: R13.1 46.2,8.1 R22.1
N$7
  Top 0.305: C1+.P$1 15.72,34.29 R203.1
N$8
  Top 0.406: R222.1 46.2,36.68 R21.1
N$9
  Top 0.305: LED1.A R1.1
N$10
  Bottom 0.305: JP1.2 86.04,24.45 93.26,24.45 X2.8
N$11
  Bottom 0.305: X2.9 93.87,21.16 93.34,20.64 85.41,20.64 JP2.2
N$12
  Bottom 0.305: R217.2 35.56,41.91 36.83,43.18 38.1,43.18 39.37,41.91 39.37,34.92 IC204.5
  Bottom 0.406: R216.2 R217.2
N$13
  Top 0.406: U$12.6 66.67,45.72 67.31,45.09 67.31,43.81 66.04,42.55 C236.2 C233.2 63.63,37.49 R235.2 TPB2A.1 R3.1
N$14  (via drill 0.5)
  Top 0.406: IC2.2 v31.11,44.45
  Bottom 0.406: v31.11,44.45 32.87,44.45 R216.1
N$15
  Top 0.406: C1.2 71.27,34.95 R3.2 71.75,37.95 U$20.3
N$16
  Bottom 0.305: 34.34,13.18 34.34,22.17 IC204.3
  Bottom 0.406: R2.2 34.34,13.18 R4.2
N$17
  Top 0.406: TPIAA1.1 C2.2 40.64,10.79 IC3.11
N$18
  Top 0.406: IC3.4 27.3,13.34 26.67,13.97 R5.2
N$19
  Top 0.406: IC3.5 27.3,12.06 26.67,11.43 R9.2
N$20  (via drill 0.5)
  Top 0.406: IC2.15 v37.47,44.45
  Bottom 0.406: v37.47,44.45 35.71,44.45 R217.1
N$21
  Top 0.406: IC2.4 27.3,41.91 26.67,42.55 R211.2
N$22
  Top 0.305: Q2.2 22.86,15.24 24.13,16.51 R8.2 R5.1
  Bottom 0.305: Q1.2 Q2.2
N$23
  Top 0.305: Q1.3 13.84,13.84 C5.2 9.15,13.84 C7.2 8.89,20.32 10.79,22.23 16.36,22.23 R7.2 | Q2.3 23.98,13.97 R8.1
  Bottom 0.305: Q1.3 Q2.3
N$24
  Top 0.305: Q4.2 23.01,8.74 R11.2 R9.1
  Bottom 0.305: Q3.2 Q4.2
N$25
  Top 0.406: TPIAA.1 C221.2 40.64,39.37 IC2.11
N$26
  Top 0.305: Q3.3 13.21,11.56 C6.1 10.14,11.58 9.17,11.58 C7.1 8.89,5.08 10.95,3.02 R10.2 | Q4.3 23.98,11.43 R11.1
  Bottom 0.305: Q3.3 Q4.3
N$27
  Top 0.406: IC2.5 27.3,40.64 26.67,40.01 R210.2
N$28
  Top 0.406: R226.2 C221.1 U$10.3
N$29
  Top 0.305: Q202.2 22.86,43.81 24.13,45.09 R212.2 R211.1
  Bottom 0.305: Q206.2 Q202.2
N$30
  Top 0.305: C1-1.P$1 16.36,19.68 R7.1
N$31
  Top 0.305: C1+1.P$1 15.72,5.71 R10.1
N$32
  Top 0.305: Q206.3 13.84,42.41 C207.2 9.15,42.41 C210.2 8.89,48.9 10.79,50.8 16.36,50.8 R204.2 | Q202.3 23.98,42.55 R212.1
  Bottom 0.305: Q206.3 Q202.3
N$33
  Top 0.406: R14.2 C2.1 U$30.3
N$34
  Top 0.406: C9.1 46.86,19.07 R12.1 46.84,18.57 47.62,17.78 47.62,15.88 | U$30.2 47.62,15.88 | 47.62,15.88 48.26,15.24 48.26,12.7 46.99,11.43 44.93,11.43 R13.2
N$35
  Top 0.406: R6.2 45.09,26.04 44.45,25.4 40.32,25.4 37.15,22.23 31.75,22.23 IC204.2
  Bottom 0.305: IC204.1 IC204.2
N$36
  Top 0.305: X2.10 93.69,18.39 92.08,20.64 87,20.64 85.72,19.37 85.72,17.14 JP3.2
N$37
  Top 0.406: C9.2 49.66,19.07 R12.2 49.68,18.57 48.9,17.78 48.9,15.24 49.53,14.61 U$30.6 TPB1A1.1 C11.1
N$38
  Top 0.406: C224.1 46.86,47.65 R225.1 46.84,47.14 47.62,46.35 47.62,44.45 | U$10.2 47.62,44.45 | 47.62,44.45 48.26,43.81 48.26,41.27 46.99,40.01 44.93,40.01 R222.2
N$39
  Top 0.305: Q204.2 23.01,37.31 R209.2 R210.1
  Bottom 0.305: Q208.2 Q204.2
N$40
  Bottom 0.305: X2.11 93.98,15.56 92.08,13.65 85.41,13.65 JP4.2
N$41
  Top 0.406: R18.2 R19.1 56.03,13.97 C13.1
N$42
  Top 0.406: C224.2 49.66,47.65 R225.2 49.68,47.14 48.9,46.35 48.9,43.81 49.53,43.18 U$10.6 TPB1A.1 C228.1
N$43
  Top 0.305: Q208.3 13.21,40.13 C206.1 10.14,40.16 9.17,40.16 C210.1 8.89,33.66 10.95,31.6 R203.2 | Q204.3 23.98,40.01 R209.1
  Bottom 0.305: Q208.3 Q204.3
N$44
  Top 0.406: C14.2 R19.2 56.36,17.14 U$31.3
N$45
  Top 0.406: R17.2 C11.2 54.76,7.62 R18.1
N$46
  Top 0.406: U$31.2 61.59,18.41 62.87,17.14 62.87,15.88 62.23,15.24 62.23,12.7 60.96,11.43 C10.1 60.83,8.91 R15.1 R16.2
N$47  (via drill 0.5)
  Top 0.406: IC3.2 v31.11,15.88
  Bottom 0.406: v31.11,15.88 32.87,15.88 R2.1
N$48  (via drill 0.5)
  Top 0.406: IC3.15 v37.47,15.88
  Bottom 0.406: v37.47,15.88 35.71,15.88 R4.1
N$49
  Top 0.406: U$12.2 61.59,46.99 62.87,45.72 62.87,44.45 62.23,43.81 62.23,41.27 60.96,40.01 C233.1 60.83,37.49 R235.1 R234.2
N$50
  Top 0.406: R236.2 C228.2 54.76,36.2 R237.1
N$51
  Top 0.406: R237.2 R233.1 56.03,42.55 C236.1
N$52
  Top 0.406: R218.2 45.09,28.57 44.45,29.21 34.92,29.21 IC204.6
  Bottom 0.305: IC204.7 IC204.6
N$53
  Top 0.406: U$31.6 66.67,17.14 67.31,16.51 67.31,15.24 66.04,13.97 C13.2 C10.2 63.63,8.91 R15.2 TPB2A1.1 R20.1
N$54
  Top 0.406: C15.2 71.27,6.37 R20.2 71.75,9.37 U$36.3
N$55
  Top 0.305: JP5.2 85.09,10.16 85.09,12.7 86.04,13.65 93.2,13.65 X2.12
N$56
  Top 0.305: X2.13 93.93,10.11 91.44,7.62 91.44,3.49 JP6.2
N$57
  Top 0.406: C235.2 R233.2 56.36,45.72 U$12.3
N$58
  Top 0.305: X2.20 92.93,25.3 JP7.2
N$59
  Bottom 0.305: X2.21 96.52,21.59 94.61,19.68 93.34,19.68 92.39,18.73 JP8.2
N$60
  Top 0.305: X2.22 96.52,19.05 94.61,17.14 91.76,17.14 JP9.2
N$61
  Bottom 0.305: X2.23 96.52,16.51 95.25,15.24 95.25,14.92 94.61,14.29 93.66,14.29 91.12,11.75 JP10.2
N$62
  Bottom 0.305: X2.24 96.52,13.97 95.25,12.7 95.25,12.06 94.61,11.43 93.03,11.43 JP11.2
N$63
  Bottom 0.305: X2.25 96.52,8.89 93.98,6.35 91.12,6.35 JP12.2
N$66
  Top 0.406: R6.1 R218.1 69.53,28.57 80.64,39.69 93.03,39.69 93.66,39.05 96.48,39.05 X2.15
SCK
  Top 0.305: 93.66,26.99 X2.7 93.34,27.3 92.71,27.3 | U$1.13 92.39,26.99 92.71,27.3 | U$1.18 92.39,30.16 92.71,29.84 92.71,27.3
VCOM  (via drill 0.5)
  Top 0.305: U$1.4 86.04,29.53 | 86.04,29.53 86.36,29.84 86.36,32.38 87.63,33.66 C22.1 | U$1.9 85.72,26.35 86.36,26.99 86.36,29.21 86.04,29.53 | C207.1 11.43,45.09 Q206.1 | C206.2 12.7,37.47 Q208.1 | C5.1 11.43,16.51 Q1.1 | C6.2 12.7,8.89 Q3.1
  Top 0.406: R226.1 44.17,47.78 C223.2 | C230.1 C235.1 | R14.1 44.17,19.2 C12.2 | C8.1 C14.1
  Bottom 0.305: Q202.1 Q206.1 11.43,45.09 11.43,39.37 Q208.1 Q204.1 | Q2.1 Q1.1 11.43,16.51 11.43,10.79 Q3.1 Q4.1
  Bottom 0.406: R22.2 R22.3 | R21.2 R21.3
  other vias: 44.45,32.38 25.4,48.9 33.02,50.16 39.37,48.9 62.23,50.8 69.22,50.8 73.03,50.8 73.66,34.92 66.04,32.38 58.42,33.66 55.88,32.38 58.42,40.01 24.13,3.81 29.21,3.81 34.29,3.81 39.37,3.81 44.45,3.81 62.23,22.23 69.22,22.23 73.03,22.23 74.93,6.35 74.93,3.81 66.04,3.81 58.42,5.08 55.88,3.81 58.42,11.43 24.13,32.38 27.94,33.66 34.29,33.66 39.37,20.32 23.5,19.68 19.05,27.3 55.88,27.3 43.81,27.3 92.71,31.11 83.82,33.66 77.47,29.84 88.9,37.47 77.47,32.38 78.74,20.95
  pour Top (isolate 0.254): 0,55.24 0,-1.91 120.65,-1.91 120.65,55.24
  pour Bottom (isolate 0.254): 0,-3.17 116.84,-3.17 116.84,56.52 0,56.52